# EAGLE schematic btkb (EAGLE 6.6.0)
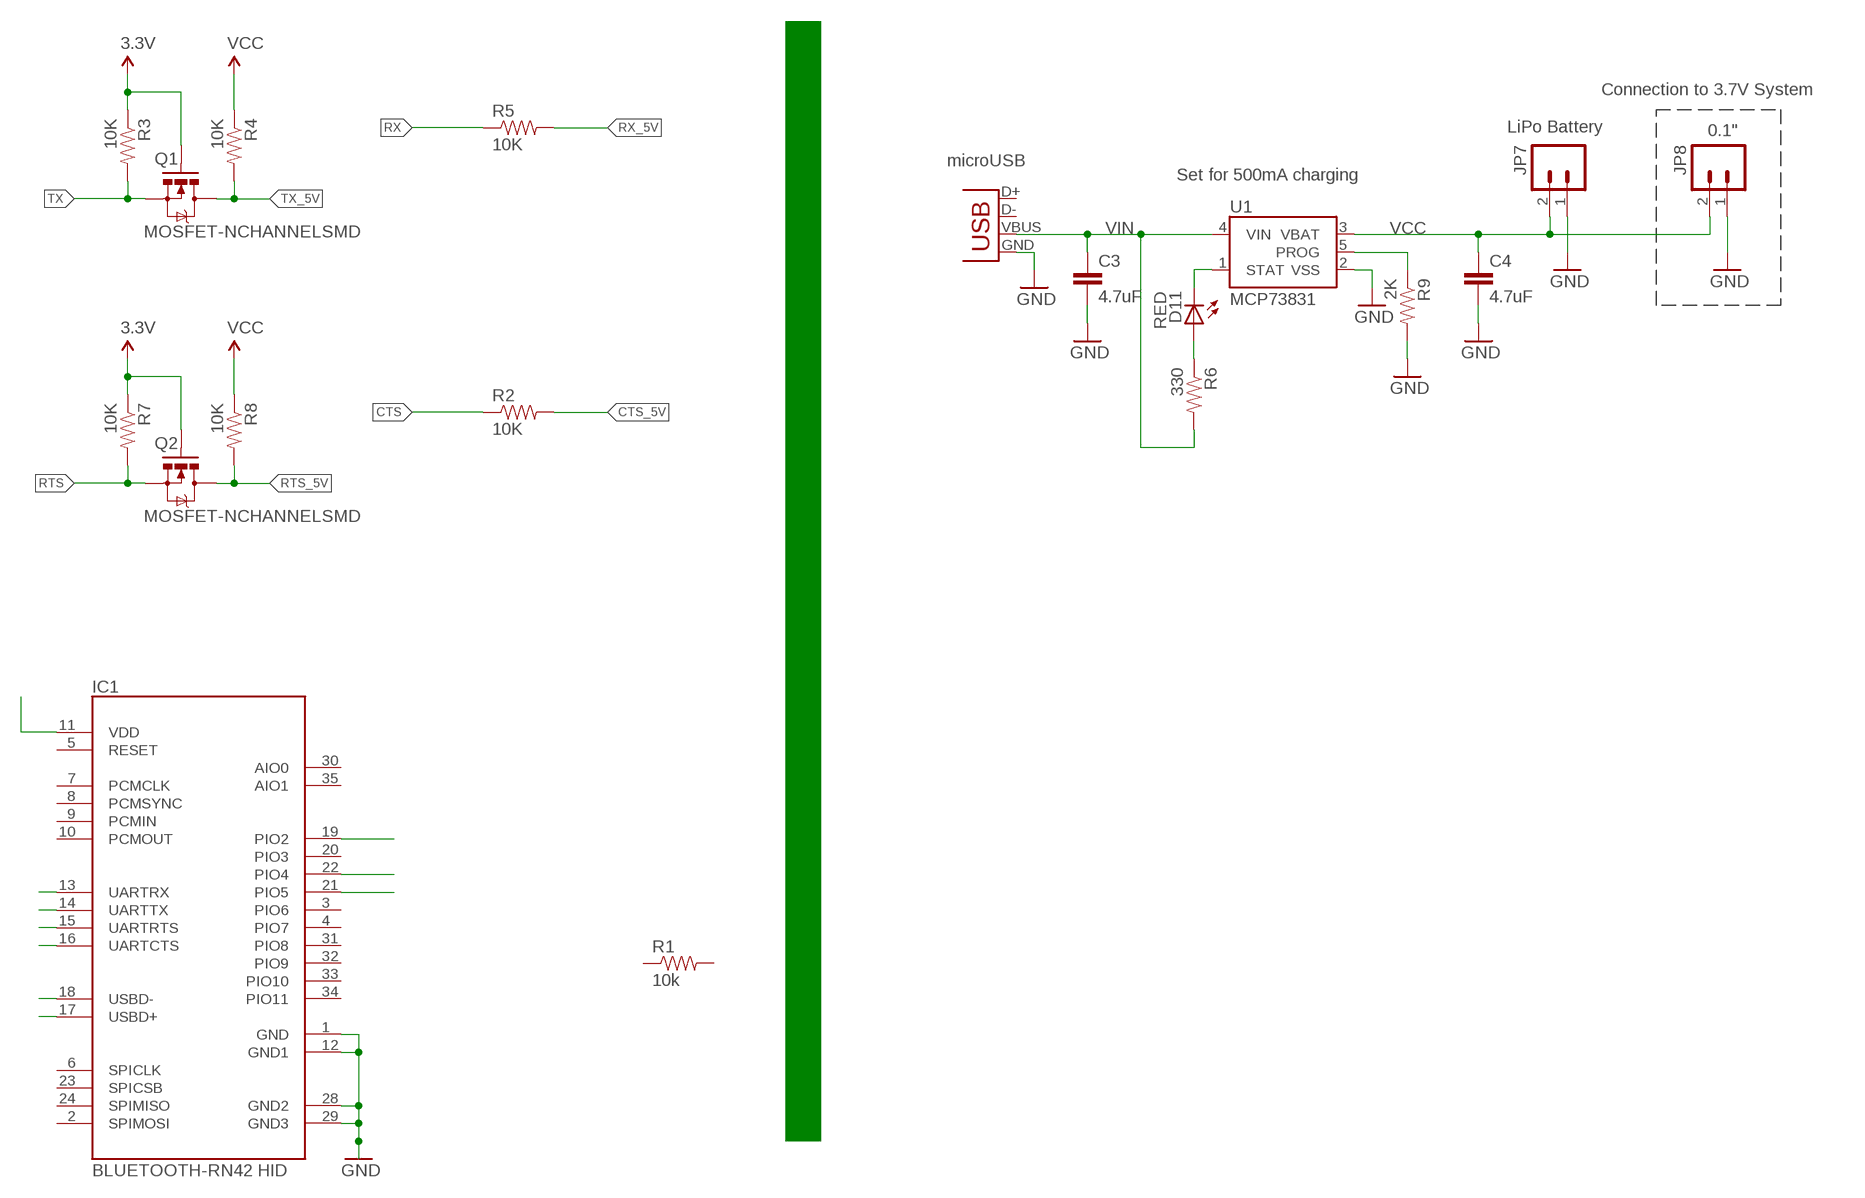
[diagram p0: schematic, sheet 1]

## Parts
C3  4.7uF  CAP0402-CAP  [0402-CAP]
C4  4.7uF  CAP0402-CAP  [0402-CAP]
D11  RED  LED0603  [LED-0603]
IC1  BLUETOOTH-RN42 HID  BLUETOOTH-RN41"  [RN41]
JP7  LiPo Battery  M02-JST-2MM-SMT  [JST-2-SMD]
JP8  M02PTH  [1X02]
Q1  MOSFET-NCHANNELSMD  [SOT23-3]
Q2  MOSFET-NCHANNELSMD  [SOT23-3]
R1  10k  0.22OHM-1/4W-1%(0805)  [0805]
R2  10K  RESISTOR0603-RES  [0603-RES]
R3  10K  RESISTOR0603-RES  [0603-RES]
R4  10K  RESISTOR0603-RES  [0603-RES]
R5  10K  RESISTOR0603-RES  [0603-RES]
R6  330  RESISTOR0402-RES  [0402-RES]
R7  10K  RESISTOR0603-RES  [0603-RES]
R8  10K  RESISTOR0603-RES  [0603-RES]
R9  2K  RESISTOR0402-RES  [0402-RES]
U1  MCP73831  [SOT23-5]
X1  Micro USB  USB-MICROB  [USB-MICROB]

## Nets
3.3V: Q1.1(G) Q2.1(G) R3.1 R7.1
CTS: R2.1
CTS_5V: R2.2
GND: C3.2 C4.2 IC1.1(GND) IC1.12(GND1) IC1.28(GND2) IC1.29(GND3) JP7.1 JP8.1 R9.2 U1.2(VSS) X1.GND
N$1: IC1.13(UARTRX)
N$2: IC1.14(UARTTX)
N$3: IC1.15(UARTRTS)
N$4: IC1.16(UARTCTS)
N$5: IC1.18(USBD-)
N$6: IC1.17(USBD+)
N$8: IC1.19(PIO2)
N$9: IC1.22(PIO4)
N$10: IC1.21(PIO5)
N$11: IC1.11(VDD)
N$12: D11.A R6.1
PROG: R9.1 U1.5(PROG)
RTS: Q2.2(S) R7.2
RTS_5V: Q2.3(D) R8.2
RX: R5.1
RX_5V: R5.2
STAT: D11.C U1.1(STAT)
TX: Q1.2(S) R3.2
TX_5V: Q1.3(D) R4.2
VCC: C4.1 JP7.2 JP8.2 R4.1 R8.1 U1.3(VBAT)
VIN: C3.1 R6.2 U1.4(VIN) X1.VBUS
Unconnected: IC1.2(SPIMOSI) IC1.3(PIO6) IC1.4(PIO7) IC1.5(RESET) IC1.6(SPICLK) IC1.7(PCMCLK) IC1.8(PCMSYNC) IC1.9(PCMIN) IC1.10(PCMOUT) IC1.20(PIO3) IC1.23(SPICSB) IC1.24(SPIMISO) IC1.30(AIO0) IC1.31(PIO8) IC1.32(PIO9) IC1.33(PIO10) IC1.34(PIO11) IC1.35(AIO1) R1.1 R1.2 X1.D+ X1.D-

## Notes on the sheet
- Connection to 3.7V System
- 0.1"
- microUSB
- Set for 500mA charging

## Library data of the parts
C3 C4 = SparkFun:CAP: Capacitor Standard 0603 ceramic capacitor, and 0.1" leaded capacitor.
D11 = SparkFun:LED: LEDs Standard schematic elements and footprints for 5mm, 3mm, 1206, and 0603 sized LEDs. 5mm - Spark Fun Electronics SKU : COM-00529 (and others)
IC1 = SparkFun-RF:BLUETOOTH-RN41: Bluetooth SMD module
JP7 JP8 = SparkFun:M02: Header 2 Standard 2-pin 0.1" header. Use with straight break away headers (SKU : PRT-00116), right angle break away headers (PRT-00553), swiss pins (PRT-00743), machine pins (PRT-00117), and female headers (PRT-00115). Molex polarized connector foot print use with SKU : PRT-08233 with associated crimp pins and housings.
Q1 Q2 = SparkFun:MOSFET-NCHANNEL
R1 = SparkFun-Resistors:0.22OHM-1/4W-1%(0805): RES-09883; PROD_ID: RES-09883; VALUE: 0.22
R2-R9 = SparkFun:RESISTOR: Resistor Basic schematic elements and footprints for 0603, 1206, and PTH resistors.
U1 = SparkFun:MCP73831: Microchip's MCP73831 Miniature single cell, fully integrated Li-Ion, Li-polymer charge management controller http://ww1.microchip.com/downloads/en/DeviceDoc/21984a.pdf
X1 = SparkFun:USB: USB Connectors USB-B-PTH is fully proven SKU : PRT-00139 USB-miniB is fully proven SKU : PRT-00587 USB-A-PCB is untested. USB-A-H is throughly reviewed, but untested. Spark Fun Electronics SKU : PRT-00437 USB-B-SMT is throughly reviewed, but untested. Needs silkscreen touching up. USB-A-S has not been used/tested USB-MB-H has not been used/tested